# EAGLE design Controlador PID digital (EAGLE 7.6.0)
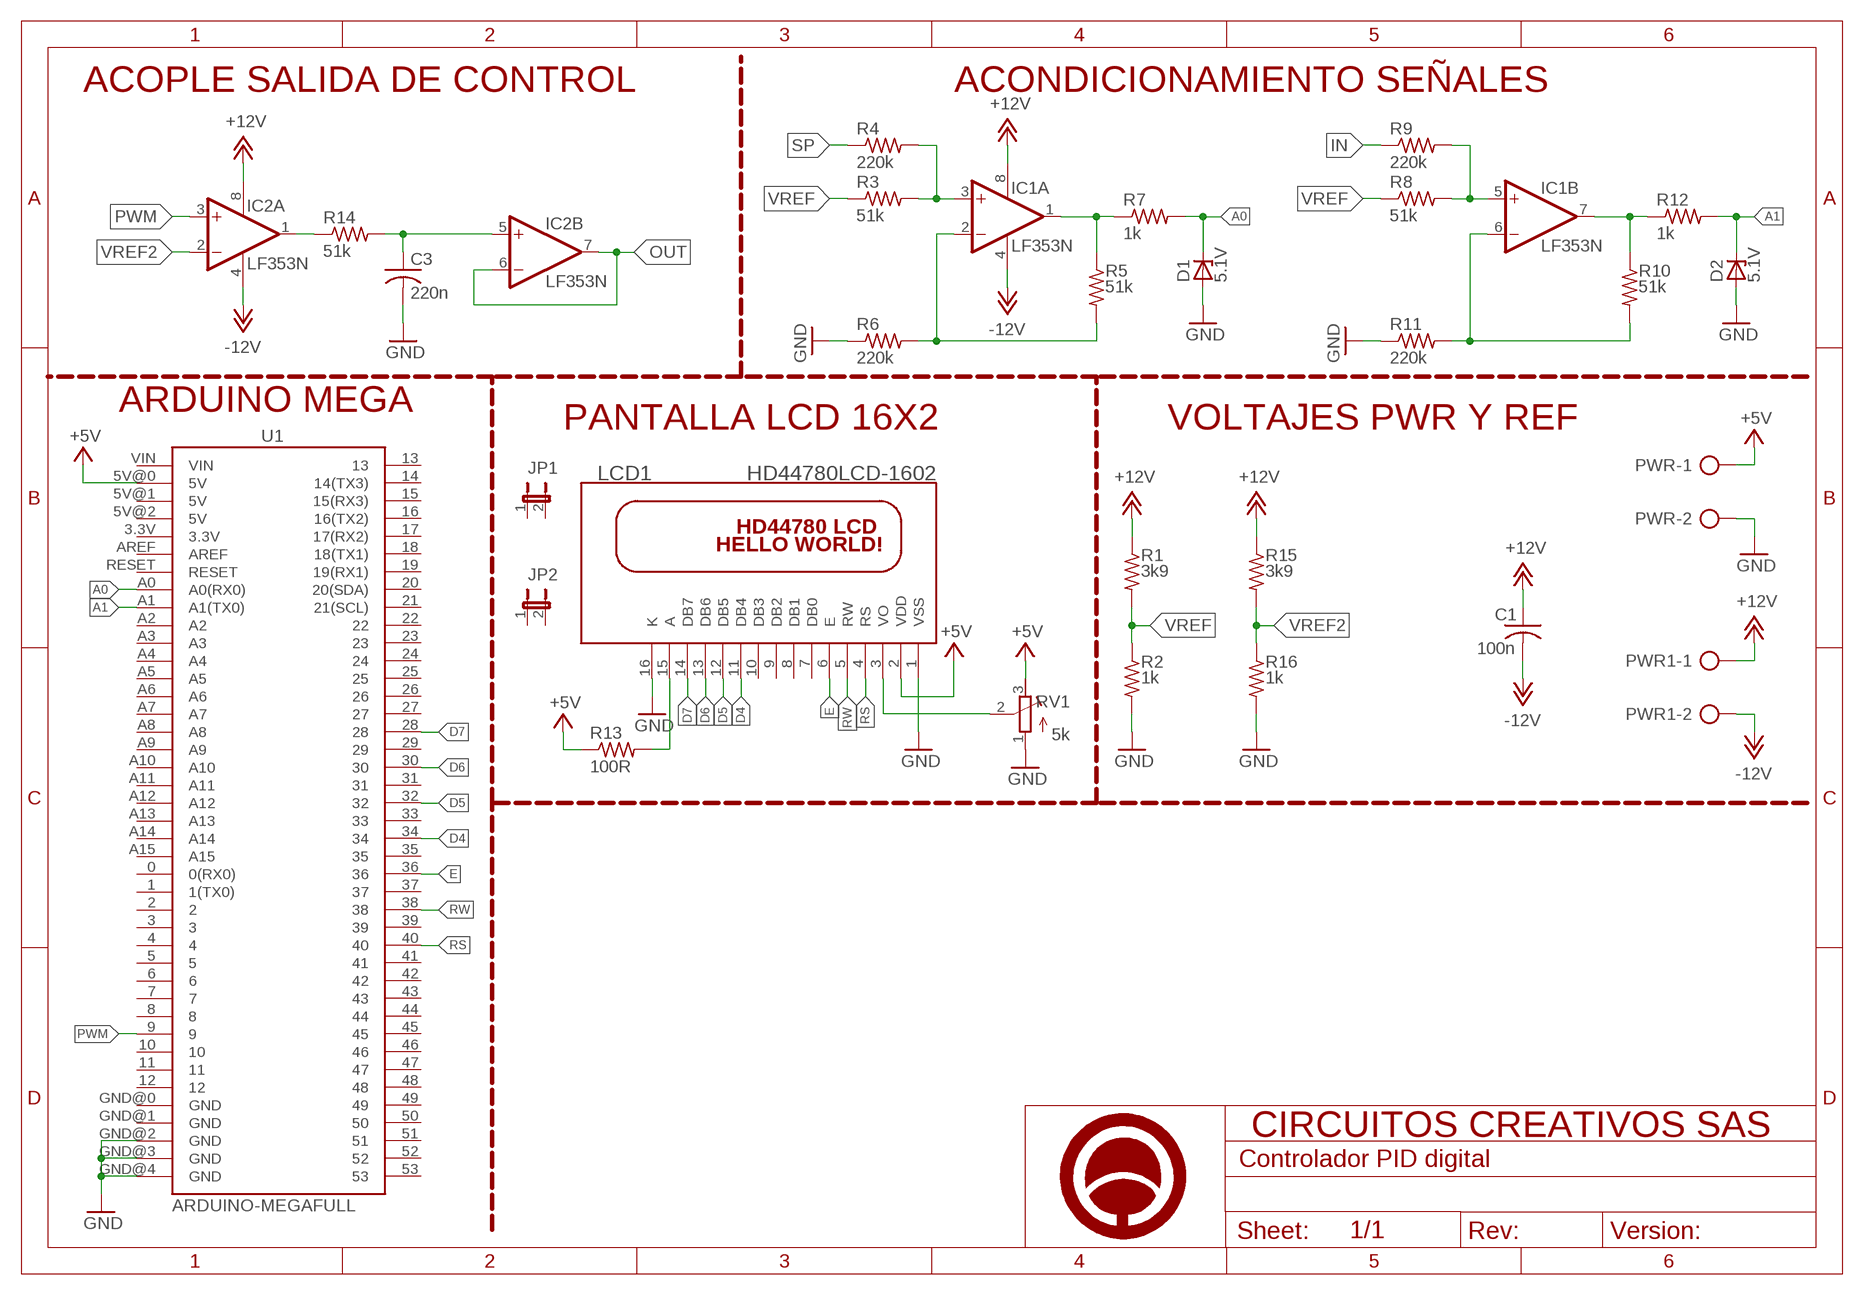
[diagram p0: schematic, sheet 1]

## Parts
C1  100n  C-US025-025X050  [C025-025X050]
C3  220n  C-US050-030X075  [C050-030X075]
D1  5.1V  ZENER-DIODEDO41Z10  [DO41Z10]
D2  5.1V  ZENER-DIODEDO41Z10  [DO41Z10]
IC1  LF353N  [DIL08]
IC2  LF353N  [DIL08]
JP1  JP1E  [JP1]
JP2  JP1E  [JP1]
LCD1  HD44780LCD-1602  [LCD1602]
PWR  AK500/2  [AK500/2]
PWR1  AK500/2  [AK500/2]
R1  3k9  R-US_0204/7  [0204/7]
R2  1k  R-US_0204/7  [0204/7]
R3  51k  R-US_0204/7  [0204/7]
R4  220k  R-US_0204/7  [0204/7]
R5  51k  R-US_0204/7  [0204/7]
R6  220k  R-US_0204/7  [0204/7]
R7  1k  R-US_0204/7  [0204/7]
R8  51k  R-US_0204/7  [0204/7]
R9  220k  R-US_0204/7  [0204/7]
R10  51k  R-US_0204/7  [0204/7]
R11  220k  R-US_0204/7  [0204/7]
R12  1k  R-US_0204/7  [0204/7]
R13  100R  R-US_0204/7  [0204/7]
R14  51k  R-US_0204/7  [0204/7]
R15  3k9  R-US_0204/7  [0204/7]
R16  1k  R-US_0204/7  [0204/7]
RV1  5k  R-TRIMM3296W  [RTRIM3296W]
U1  ARDUINO-MEGAFULL  [ARDUINO_MEGA]
U$1  A4_HORIZONTAL  [LOGO]

## Nets
+5V: LCD1.2(VDD) PWR.1 R13.1 RV1.3(E) U1.5V@0(5V)
+12V: C1.1 IC1.8(P:V+) IC2.8(P:V+) PWR1.1 R1.1 R15.1
-12V: C1.2 IC1.4(P:V-) IC2.4(P:V-) PWR1.2
A0: D1.C R7.2 U1.A0(A0(RX0))
A1: D2.C R12.2 U1.A1(A1(TX0))
D4: LCD1.11(DB4) U1.34
D5: LCD1.12(DB5) U1.32
D6: LCD1.13(DB6) U1.30
D7: LCD1.14(DB7) U1.28
E: LCD1.6(E) U1.36
GND: C3.2 D1.A D2.A LCD1.1(VSS) LCD1.16(K) PWR.2 R2.2 R6.1 R11.1 R16.2 RV1.1(A) U1.GND@2(GND) U1.GND@3(GND) U1.GND@4(GND)
IN: R9.1
N$1: IC1.5(B:+IN) R8.2 R9.2
N$2: IC1.2(A:-IN) R5.2 R6.2
N$3: IC1.6(B:-IN) R10.2 R11.2
N$4: IC1.3(A:+IN) R3.2 R4.2
N$5: IC1.1(A:OUT) R5.1 R7.1
N$6: IC1.7(B:OUT) R10.1 R12.1
N$7: IC2.1(A:OUT) R14.1
N$8: C3.1 IC2.5(B:+IN) R14.2
N$34: LCD1.3(VO) RV1.2(S)
N$46: LCD1.15(A) R13.2
OUT: IC2.6(B:-IN) IC2.7(B:OUT)
PWM: IC2.3(A:+IN) U1.9
RS: LCD1.4(RS) U1.40
RW: LCD1.5(RW) U1.38
SP: R4.1
VREF: R1.2 R2.1 R3.1 R8.1
VREF2: IC2.2(A:-IN) R15.2 R16.1
Unconnected: JP1.1 JP1.2 JP2.1 JP2.2 LCD1.7(DB0) LCD1.8(DB1) LCD1.9(DB2) LCD1.10(DB3) U1.0(0(RX0)) U1.1(1(TX0)) U1.2 U1.3 U1.3.3V U1.4 U1.5 U1.5V@1(5V) U1.5V@2(5V) U1.6 U1.7 U1.8 U1.10 U1.11 U1.12 U1.13 U1.14(14(TX3)) U1.15(15(RX3)) U1.16(16(TX2)) U1.17(17(RX2)) U1.18(18(TX1)) U1.19(19(RX1)) U1.20(20(SDA)) U1.21(21(SCL)) U1.22 U1.23 U1.24 U1.25 U1.26 U1.27 U1.29 U1.31 U1.33 U1.35 U1.37 U1.39 U1.41 U1.42 U1.43 U1.44 U1.45 U1.46 U1.47 U1.48 U1.49 U1.50 U1.51 U1.52 U1.53 U1.A2 U1.A3 U1.A4 U1.A5 U1.A6 U1.A7 U1.A8 U1.A9 U1.A10 U1.A11 U1.A12 U1.A13 U1.A14 U1.A15 U1.AREF U1.GND@0(GND) U1.GND@1(GND) U1.RESET U1.VIN

## Notes on the sheet
- ACOPLE SALIDA DE CONTROL | ACONDICIONAMIENTO SEÑALES
- ARDUINO MEGA
- PANTALLA LCD 16X2 | VOLTAJES PWR Y REF

## Library data of the parts
C1 C3 = rcl:C-US: CAPACITOR, American symbol
D1 D2 = diode:ZENER-DIODE: Z-Diode
IC1 IC2 = linear:LF353: OP AMP
JP1 JP2 = jumper:JP1E: JUMPER
LCD1 = adafruit:HD44780LCD: HD44780 LCD Standard character type LCDs, available in sizes from 8x1 to 40x4!
PWR PWR1 = con-ptr500:AK500/2: CONNECTOR; OC_FARNELL: unknown; OC_NEWARK: unknown
R1-R16 = rcl:R-US_: RESISTOR, American symbol
RV1 = rcl:R-TRIMM: Trimm resistor
U1 = SparkFun-Boards:ARDUINO-MEGA: Arduino Mega board footprint
U$1 = Circuitos-Creativos-Estilos:A4_HORIZONTAL

## Board
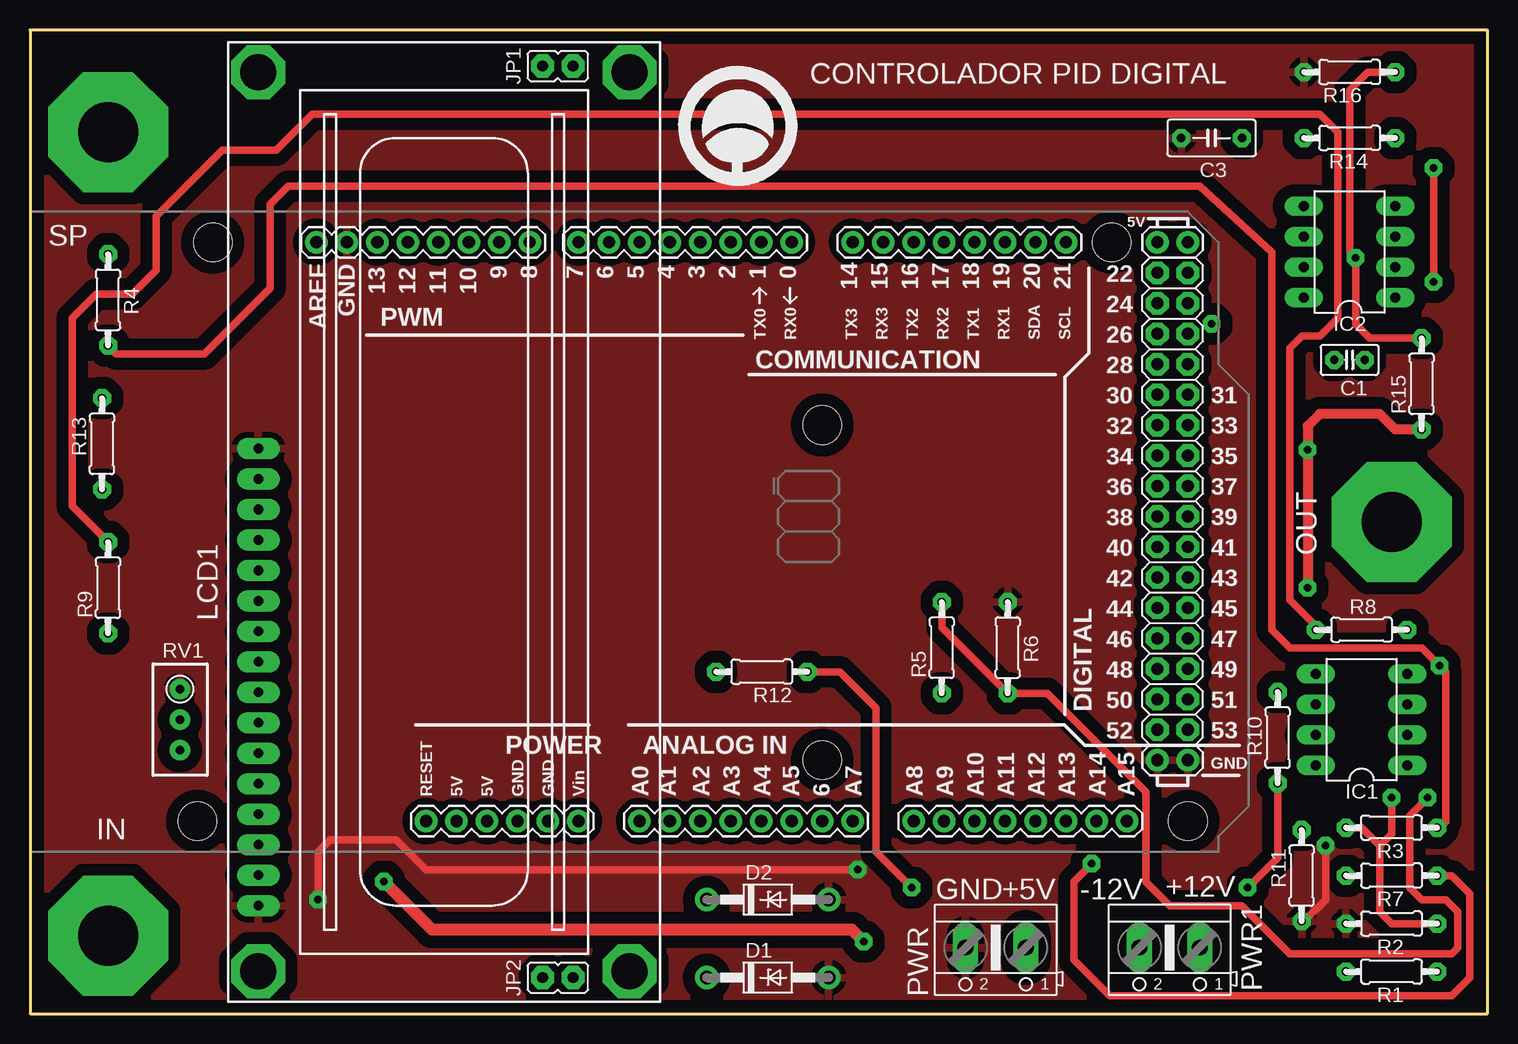
[diagram p1: board, top side]
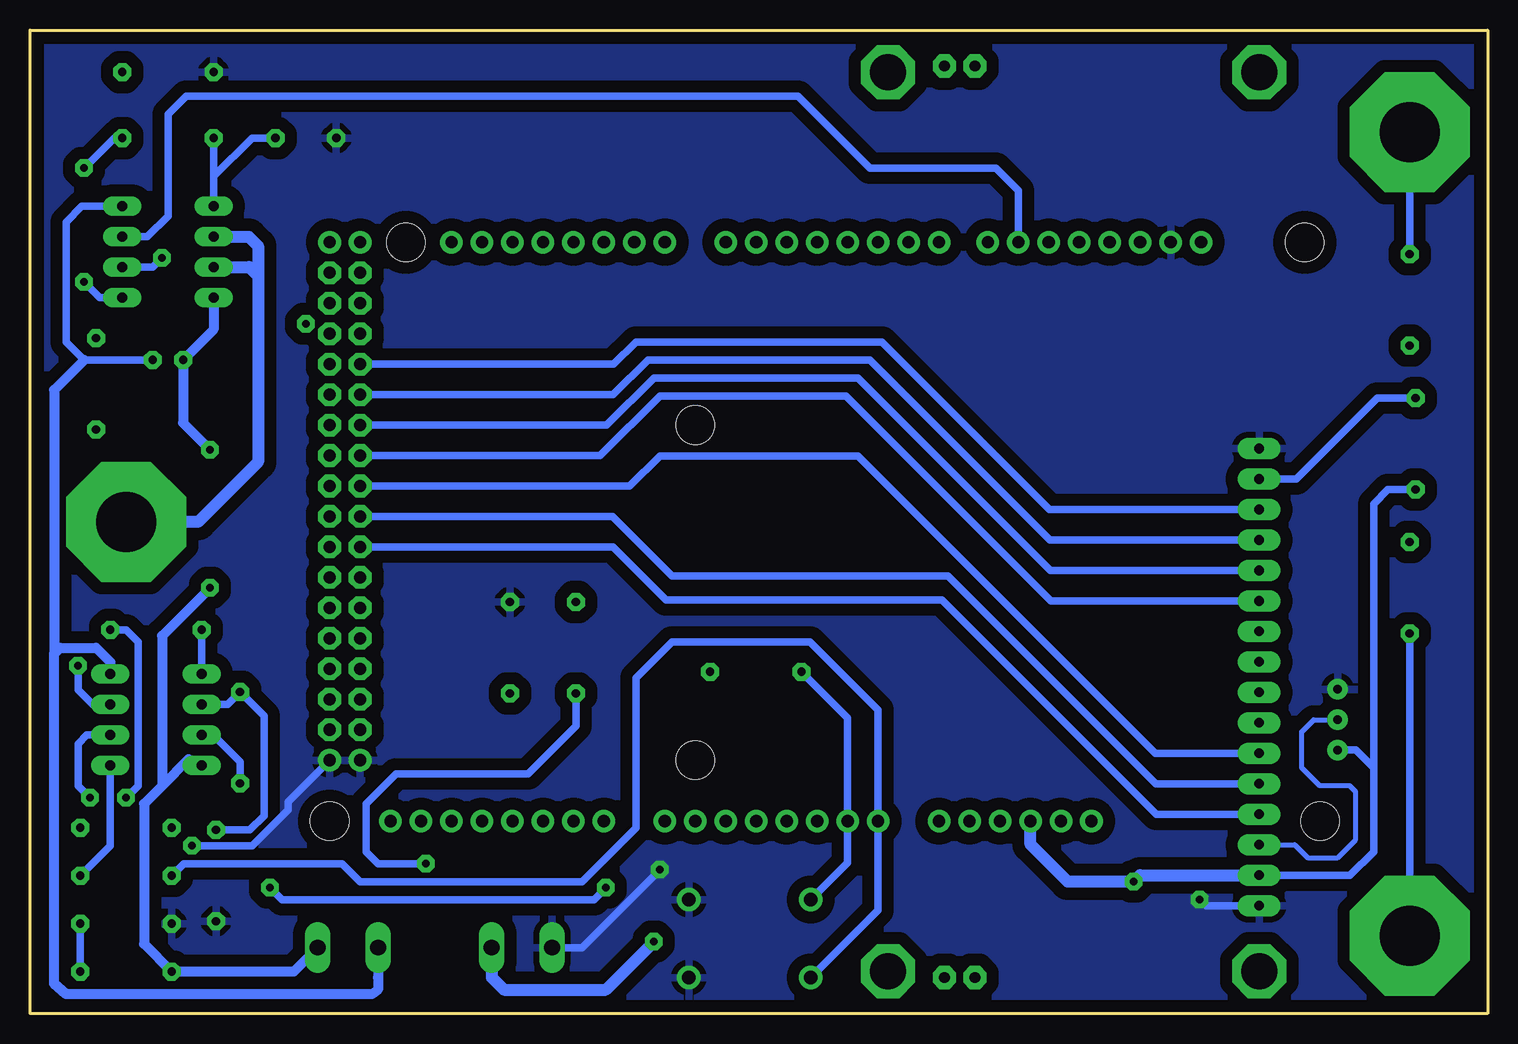
[diagram p2: board, bottom side, seen from below]

Size 121.5 x 82 mm. Coordinates in mm from the lower left corner, seen from the top.
Outline: 0,0 121.5,0 121.5,82 0,82 0,0
Copper layers (1*16): Top 0.035mm / dielectric 1.5mm / Bottom 0.035mm
Design rules "Circuitos_Creativos_2_capas": minimum track width 0.4mm, minimum drill 0.6mm, track to track 10mil, track to pad 10mil, pad to pad 10mil, via to via 10mil, smd to smd 8mil, copper to edge 1mm, drill to drill 15mil, minimum pad ring 0.4mm, minimum via ring 0.4mm, stop-mask expansion 4mil, vias tented up to drill 0mil, thermal gap 20mil

### Footprints (pad centres in the part's own frame; a part is rotated, then mirrored left to right if it is on the bottom)
C025-025X050 = drill 0.7 pad 1.422 octagon: 1 -1.27,0; 2 1.27,0
C050-030X075 = drill 0.7 pad 1.422 octagon: 1 -2.54,0; 2 2.54,0
DO41Z10 = drill 1.1 pad 1.93: A 5.08,0; C -5.08,0
DIL08 = drill 0.813 pad 1.27 long: 1 -3.81,-3.81; 2 -1.27,-3.81; 3 1.27,-3.81; 4 3.81,-3.81; 5 3.81,3.81; 6 1.27,3.81; 7 -1.27,3.81; 8 -3.81,3.81
JP1 = drill 0.9 pad 1.93 octagon: 1 0,-1.27; 2 0,1.27
LCD1602 = drill 0.8 pad 1.778 long: 1 8,33.46; 2 10.54,33.46; 3 13.08,33.46; 4 15.62,33.46; 5 18.16,33.46; 6 20.7,33.46; 7 23.24,33.46; 8 25.78,33.46; 9 28.32,33.46; 10 30.86,33.46; 11 33.4,33.46; 12 35.94,33.46; 13 38.48,33.46; 14 41.02,33.46; 15 43.56,33.46; 16 46.1,33.46 | drill 3 octagon: P1 2.54,33.46; P2 2.54,2.54; P3 77.46,2.54; P4 77.46,33.46
AK500/2 = drill 1.321 long: 1 -2.515,0; 2 2.515,0
0204/7 = drill 0.7 pad 1.422 octagon: 1 -3.81,0; 2 3.81,0
RTRIM3296W = drill 0.7 pad 1.676: 1 0,-2.54; 2 0,0; 3 0,2.54
ARDUINO_MEGA = drill 1.016 pad 1.88: 0 63.5,50.8; 1 60.96,50.8; 2 58.42,50.8; 3 55.88,50.8; 3.3V 35.56,2.54; 4 53.34,50.8; 5 50.8,50.8; 5V@0 38.1,2.54; 5V@1 93.98,50.8; 5V@2 96.52,50.8; 6 48.26,50.8; 7 45.72,50.8; 8 41.656,50.8; 9 39.116,50.8; 10 36.576,50.8; 11 34.036,50.8; 12 31.496,50.8; 13 28.956,50.8; 14 68.58,50.8; 15 71.12,50.8; 16 73.66,50.8; 17 76.2,50.8; 18 78.74,50.8; 19 81.28,50.8; 20 83.82,50.8; 21 86.36,50.8; A0 50.8,2.54; A1 53.34,2.54; A2 55.88,2.54; A3 58.42,2.54; A4 60.96,2.54; A5 63.5,2.54; A6 66.04,2.54; A7 68.58,2.54; A8 73.66,2.54; A9 76.2,2.54; A10 78.74,2.54; A11 81.28,2.54; A12 83.82,2.54; A13 86.36,2.54; A14 88.9,2.54; A15 91.44,2.54; AREF 23.876,50.8; GND@0 40.64,2.54; GND@1 43.18,2.54; GND@2 93.98,7.62; GND@3 96.52,7.62; GND@4 26.416,50.8; RESET 33.02,2.54; VIN 45.72,2.54 | drill 1.016 pad 1.88 octagon: 22 93.98,48.26; 23 96.52,48.26; 24 93.98,45.72; 25 96.52,45.72; 26 93.98,43.18; 27 96.52,43.18; 28 93.98,40.64; 29 96.52,40.64; 30 93.98,38.1; 31 96.52,38.1; 32 93.98,35.56; 33 96.52,35.56; 34 93.98,33.02; 35 96.52,33.02; 36 93.98,30.48; 37 96.52,30.48; 38 93.98,27.94; 39 96.52,27.94; 40 93.98,25.4; 41 96.52,25.4; 42 93.98,22.86; 43 96.52,22.86; 44 93.98,20.32; 45 96.52,20.32; 46 93.98,17.78; 47 96.52,17.78; 48 93.98,15.24; 49 96.52,15.24; 50 93.98,12.7; 51 96.52,12.7; 52 93.98,10.16; 53 96.52,10.16 | hole 3.2: 15.24,50.8; 13.97,2.54; 66.04,35.56; 66.04,7.62; 90.17,50.8; 96.52,2.54

### Placement (x,y rotation side)
C1  110,54.5 0 top
C3  98.5,73 180 top
D1  61.5,3 0 top
D2  61.5,9.5 0 top
IC1  111,24.5 90 top
IC2  110,63.5 90 top
JP1  44,79 90 top
JP2  44,3 90 top
LCD1  52.5,1 90 top
PWR  80.5,5.5 180 top
PWR1  95,5.5 180 top
R1  113.5,3.5 0 top
R2  113.5,7.5 180 top
R3  113.5,15.5 0 top
R4  6.5,59.5 270 top
R5  76,30.5 90 top
R6  81.5,30.5 270 top
R7  113.5,11.5 180 top
R8  111,32 180 top
R9  6.5,35.5 90 top
R10  104,23 90 top
R11  106,11.5 90 top
R12  61,28.5 180 top
R13  6,47.5 90 top
R14  110,73 180 top
R15  116,52.5 90 top
R16  110,78.5 180 top
RV1  12.5,24.5 180 top
U1  0,13.5 0 top
U$1  59,74 0 top

### Tracks (layer width: path | path; a pad name or v marks a point on that pad's centre or on a via)
+5V  (via drill 0.6 pad 1.42)
  Top 1.016: v69.5,6 68.5,7 33.5,7 v29.5,11
  Bottom 0.61: RV1.3 10.96,21.96 9.5,20.5 | 9.5,20.5 9.5,13.5 11.46,11.54 LCD1.2 | R13.1 8.31,43.69 9.5,42.5 9.5,20.5
  Bottom 1.016: PWR.1 83.02,3.02 82,2 73.5,2 v69.5,6 | LCD1.2 28.96,11.54 v29.5,11 35,11 38.1,14.1 U1.5V@0
+12V  (via drill 0.6 pad 1.42)
  Top 0.813: v106.5,35.5 v106.5,47 106.5,49 107.5,50 112.5,50 113.81,48.69 R15.1
  Bottom 0.813: IC1.8 108.31,21.19 110.5,19 | IC2.8 106.19,57.04 C1.1 108.73,49.23 v106.5,47 | v106.5,35.5 110.5,31.5 110.5,19 | PWR1.1 99.52,3.5 R1.1 112,5.81 112,17.5 110.5,19
-12V
  Bottom 0.61: C1.2 117,54.5 118.5,56 118.5,66 117.19,67.31 IC2.4
  Bottom 0.813: PWR1.2 92.48,3.02 92.5,3 92.5,2 93,1.62 118.5,1.62 119.5,2.5 119.5,30 | 119.5,30 119,30.5 116,30.5 114.81,29.31 IC1.4 | 117,54.5 119.5,52 119.5,30
A0
  Bottom 0.61: D1.C 50.8,8.62 U1.A0 50.8,25.3 56.5,31 68,31 71,28 71,15.5 75.5,11 94,11 95.5,12.5 108.69,12.5 R7.2
A1
  Bottom 0.61: D2.C 53.34,12.58 U1.A1 53.34,24.65 R12.2
D4
  Bottom 0.61: U1.34 73.98,46.52 69,51.5 53.5,51.5 36.4,34.4 LCD1.11
D5
  Bottom 0.61: U1.32 73.44,49.06 69.5,53 52.5,53 36.44,36.94 LCD1.12
D6
  Bottom 0.61: U1.30 72.9,51.6 70,54.5 51.5,54.5 36.48,39.48 LCD1.13
D7
  Bottom 0.61: U1.28 72.86,54.14 71,56 50.5,56 36.52,42.02 LCD1.14
E
  Bottom 0.61: U1.36 71.52,43.98 69,46.5 52.5,46.5 27.7,21.7 LCD1.6
GND  (via drill 0.6 pad 1.42)
  Top 0.61: R11.1 106.19,7.69 108,9.5 v108,14 | v69,12 33,12 30.5,14.5 25,14.5 24,13.5 v24,9.5
  Bottom 0.61: v108,14 103,14 100,17 100,17.64 U1.GND@3 | PWR.2 75.5,5.5 v69,12 | v24,9.5 23.5,9 LCD1.1
  pour Bottom (isolate 1.016): -1,-1 122.5,-1 122.5,83 -1,83
  pour Top (isolate 1.016): -2,-2 123.5,-2 123.5,84 -2,84
IN  (via drill 5 pad 10)
  Bottom 0.61: v6.5,6.5 R9.1
N$1
  Top 0.61: R8.2 107.19,32.31 105,34.5 105,55.5 106,56.5 107.5,56.5 109,58 109,73.5 107.5,75 23.5,75 20.5,72 16,72 10.5,66.5 10.5,62 8.5,60 5.5,60 3.5,58 3.5,42.31 R9.2
  Bottom 0.61: R8.2 IC1.5
N$2  (via drill 0.6 pad 1.42)
  Top 0.61: R5.2 76,32.19 R6.2 84.81,26.69 93,18.5 93,11 95,9 101,9 105,5 118.5,5 119,5.5 119,8.5 118,9.5 116,9.5 115,10.5 115,16.5 v116.5,18
  Bottom 0.61: IC1.2 116.77,23.23 117.5,22.5 117.5,19 v116.5,18
N$3
  Bottom 0.61: IC1.6 105.04,25.77 R10.2 102,24.81 102,16.5 103.19,15.31 R11.2
N$4  (via drill 0.6 pad 1.42)
  Top 0.61: R4.2 7.19,55 14.5,55 20,60.5 20,67.5 21.5,69 97.5,69 103.5,63.5 103.5,32 105,30.5 116,30.5 v117.5,29 118,28.5 118,16 117.5,15.5 R3.2
  Bottom 0.61: IC1.3 116.27,25.77 117.5,27 v117.5,29
N$5  (via drill 0.6 pad 1.42)
  Top 0.61: v88.5,12.5 87,11 87,4.5 90,1.5 118.5,1.5 120,3 120,10 118.5,11.5 R7.1
  Bottom 0.61: IC1.1 114.81,14 R7.1 | R5.1 76,24 80,20 91,20 93.5,17.5 93.5,13.5 92.5,12.5 v88.5,12.5
N$6  (via drill 0.6 pad 1.42)
  Top 0.61: v73.5,10.5 70.5,13.5 70.5,25.5 67.5,28.5 R12.1 | R10.1 104,13 v101.5,10.5
  Bottom 0.61: IC1.7 106.23,23.23 104,21 R10.1 | v73.5,10.5 74.5,9.5 100.5,9.5 v101.5,10.5
N$7  (via drill 0.6 pad 1.42)
  Top 0.61: v117,61 v117,70.5
  Bottom 0.61: R14.1 114.5,73 v117,70.5 | v117,61 115.69,59.69 IC2.1
N$8
  Bottom 0.61: C3.1 103,73 106.19,69.81 | 106.19,69.81 106.19,69.5 IC2.5 | R14.2 106.19,69.81
N$9  (via drill 0.6 pad 1.42)
  other vias: 98.5,57.5
N$34
  Bottom 0.406: LCD1.3 16.08,14.08 15,13 12.5,13 11,14.5 11,18.5 11.5,19 14,19 15.5,20.5 15.5,23.5 14.5,24.5 RV1.2
N$46
  Bottom 0.61: LCD1.15 15.94,44.56 9.19,51.31 R13.2
OUT  (via drill 5 pad 10)
  Bottom 1.016: IC2.7 103.23,62.23 102.5,61.5 | 102.5,61.5 102.5,46 107.5,41 v113.5,41 | IC2.6 103.27,64.77 102.5,64 102.5,61.5
PWM
  Bottom 0.61: IC2.3 111.73,64.77 110,66.5 110,75 108.5,76.5 57.5,76.5 51.5,70.5 41,70.5 39.12,68.62 U1.9
RS
  Bottom 0.61: U1.40 72.9,38.9 68.5,34.5 45.5,34.5 27.62,16.62 LCD1.4
RW
  Bottom 0.61: U1.38 72.94,41.44 68,36.5 45,36.5 27.66,19.16 LCD1.5
SP  (via drill 5 pad 10)
  Bottom 0.61: v6.5,73.5 R4.1
VREF  (via drill 0.6 pad 1.42)
  Top 0.61: R3.1 111,15.5 112.5,14 | 112.5,14 112.5,8.5 113.5,7.5 R2.1 | v113.5,18 113.5,15 112.5,14
  Bottom 0.61: R2.1 R1.2 | R8.1 113.5,32 112.5,31 112.5,19 v113.5,18
VREF2  (via drill 0.6 pad 1.42)
  Top 0.61: R16.1 111.5,78.5 110,77 110,63.5 v110.5,63 110.5,57.5 111.69,56.31 R15.2
  Bottom 0.61: v110.5,63 111.27,62.23 IC2.2

### Text on the board
tPlace: CONTROLADOR PID DIGITAL | SP | OUT | IN | +12V | GND | +5V | -12V